# EAGLE schematic Controller3 (EAGLE 6.1)
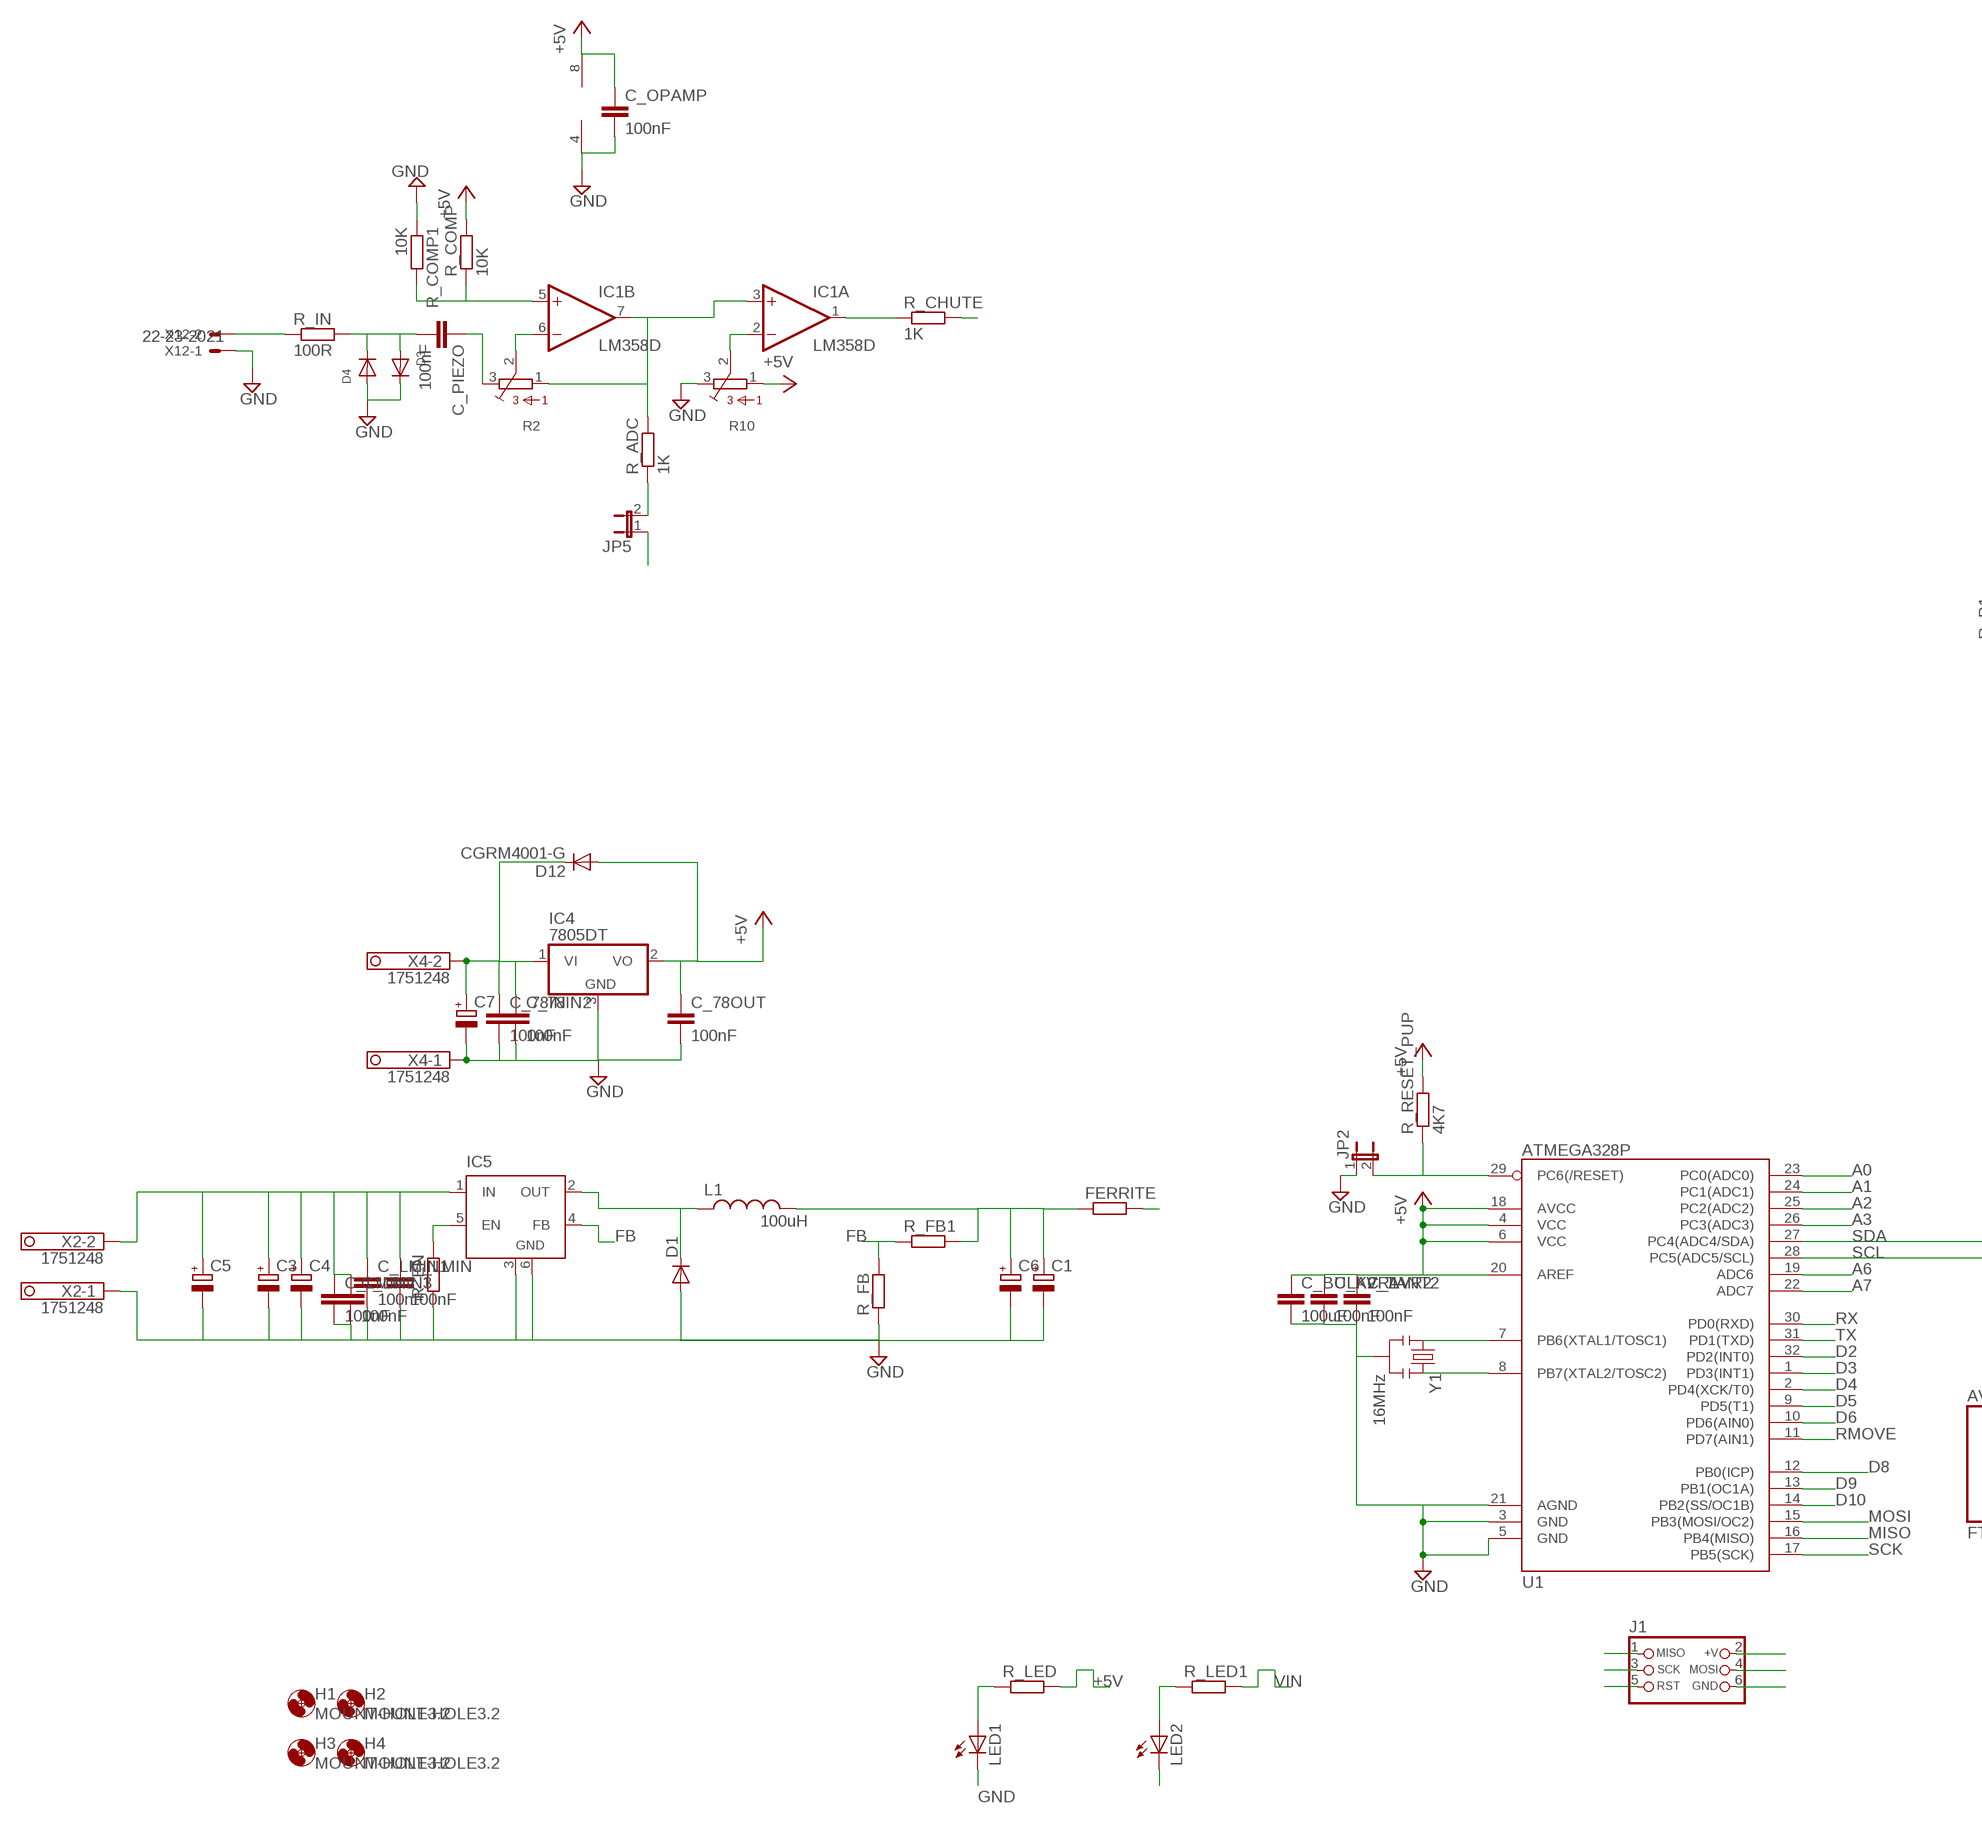
[diagram p0: schematic, sheet 1, part 1 of 2]
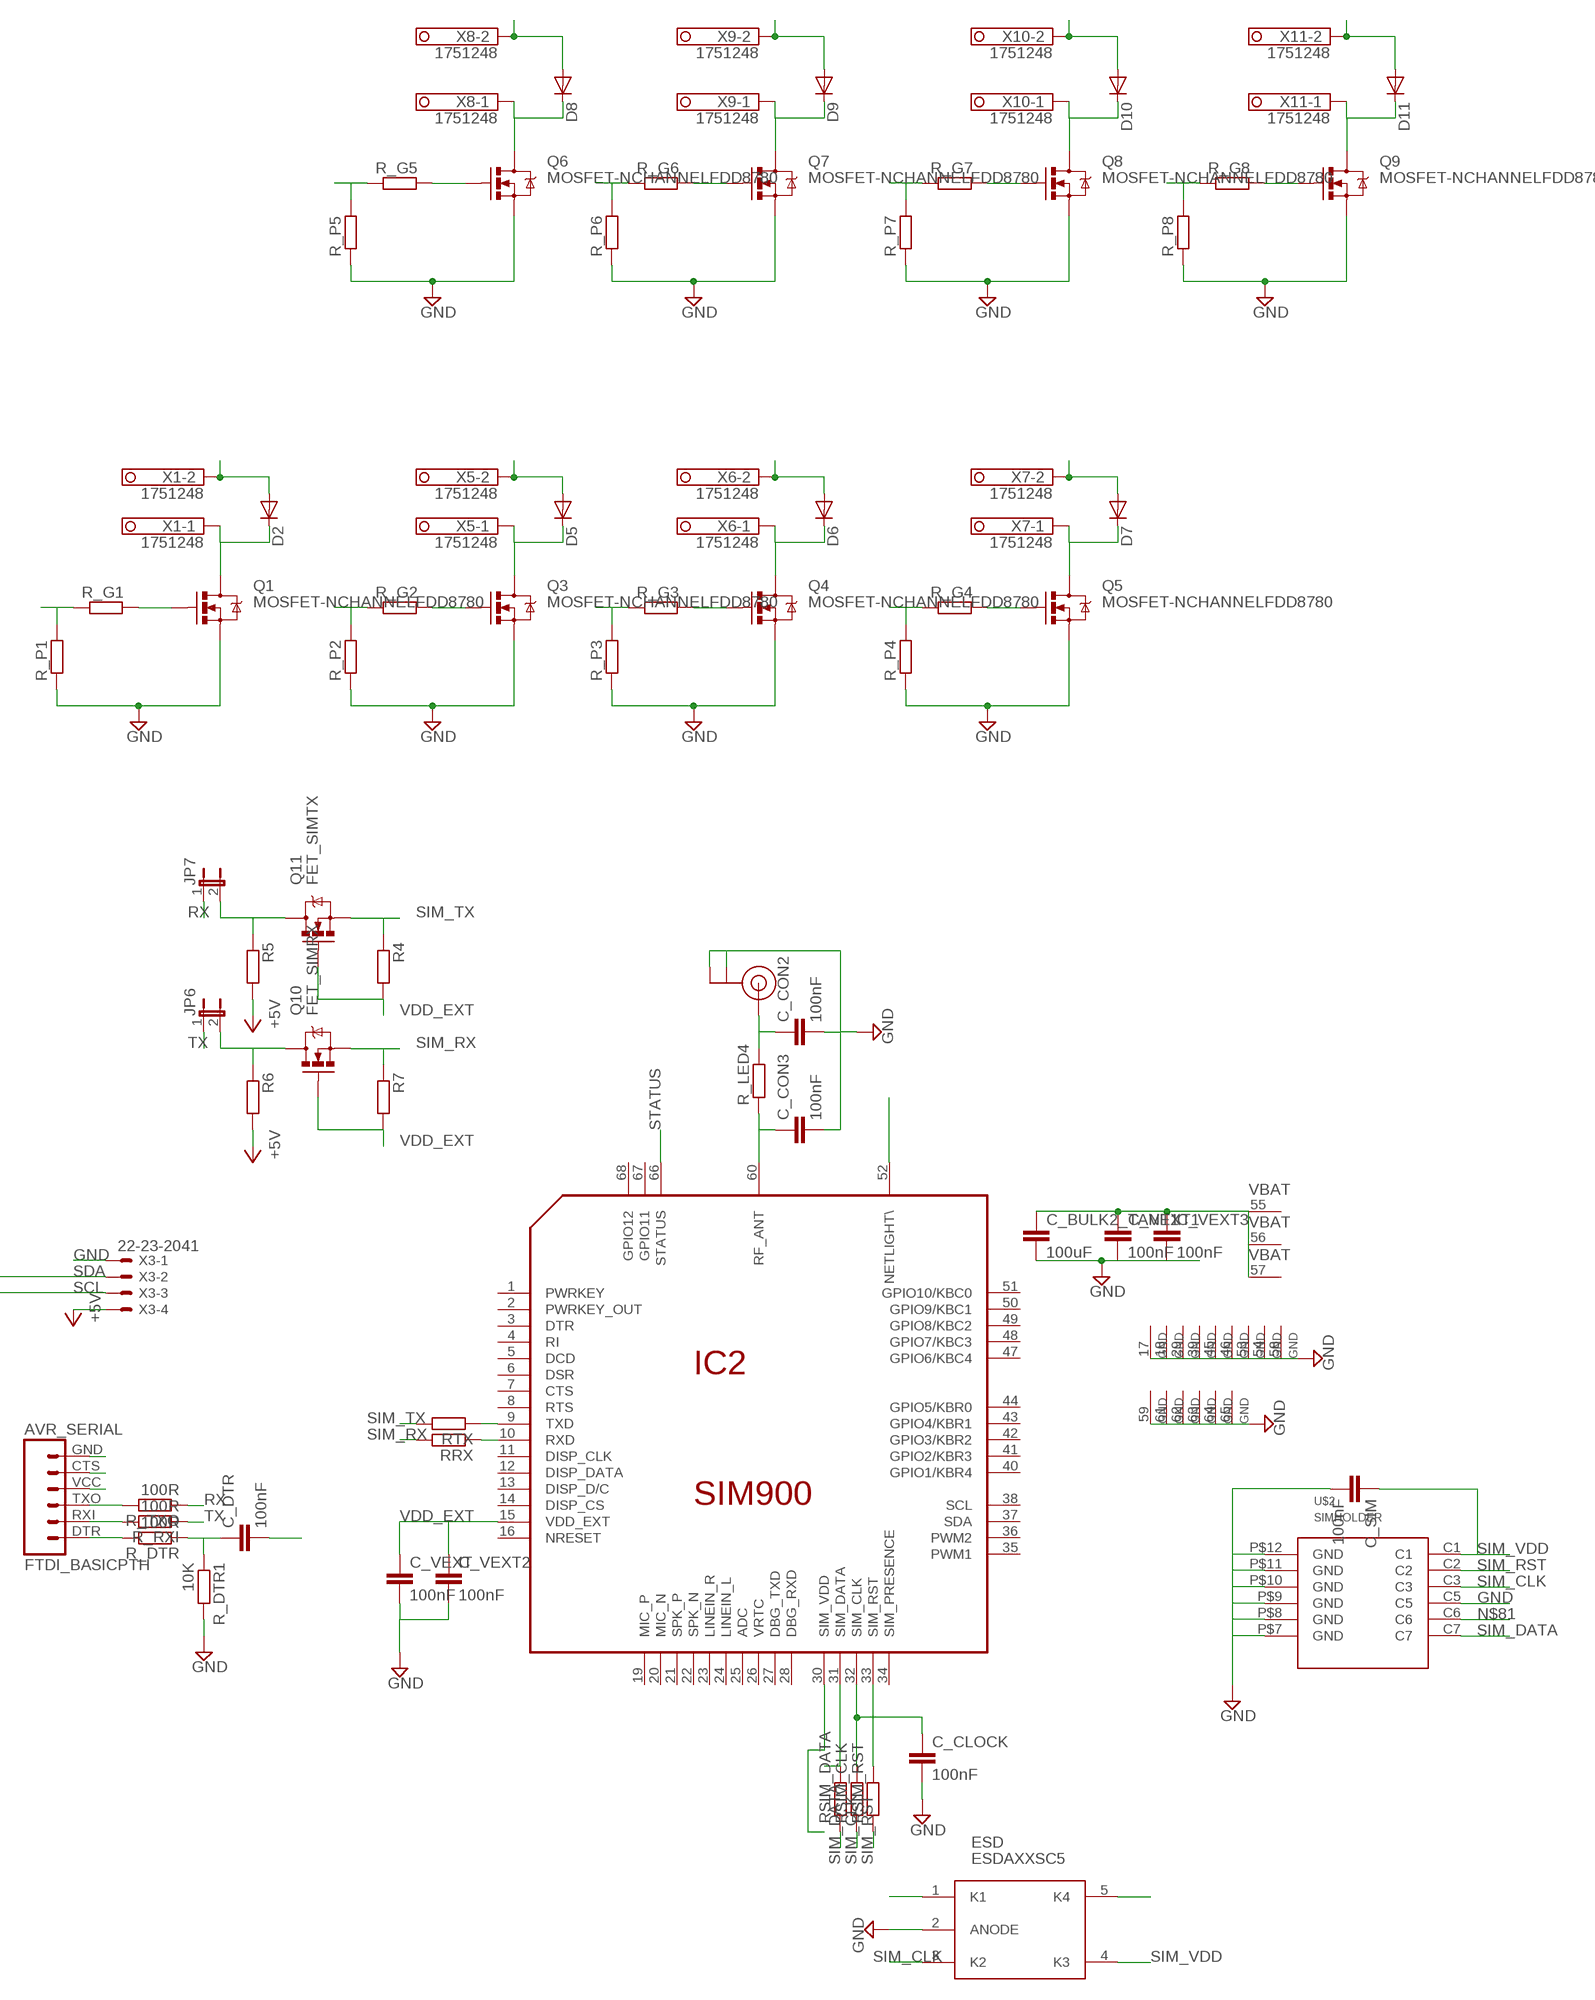
[diagram p1: schematic, sheet 1, part 2 of 2]

## Parts
AVR_SERIAL  FTDI_BASICPTH  [FTDI_BASIC]
C1  CPOL-EUF  [PANASONIC_F]
C3  CPOL-EUF  [PANASONIC_F]
C4  CPOL-EUF  [PANASONIC_F]
C5  CPOL-EUF  [PANASONIC_F]
C6  CPOL-EUF  [PANASONIC_F]
C7  CPOL-EUF  [PANASONIC_F]
C_78IN  100nF  C-EUC0805  [C0805]
C_78IN2  100nF  C-EUC0805  [C0805]
C_78OUT  100nF  C-EUC0805  [C0805]
C_AVR1  100nF  C-EUC0805K  [C0805K]
C_AVR2  100nF  C-EUC0805  [C0805]
C_BULK2_TANT1  100uF  C-EUC1210  [C1210]
C_BULK2_TANT2  100uF  C-EUC1210  [C1210]
C_CLOCK  100nF  C-EUC0805  [C0805]
C_CON2  100nF  C-EUC0805  [C0805]
C_CON3  100nF  C-EUC0805  [C0805]
C_DTR  100nF  C-EUC0805K  [C0805K]
C_LMIN  100nF  C-EUC0805  [C0805]
C_LMIN1  100nF  C-EUC0805  [C0805]
C_LMIN2  100nF  C-EUC0805  [C0805]
C_LMIN3  100nF  C-EUC0805  [C0805]
C_OPAMP  100nF  C-EUC0805K  [C0805K]
C_PIEZO  100nF  C-EUC0805K  [C0805K]
C_SIM  100nF  C-EUC0805  [C0805]
C_VEXT  100nF  C-EUC0805K  [C0805K]
C_VEXT1  100nF  C-EUC0805K  [C0805K]
C_VEXT2  100nF  C-EUC0805K  [C0805K]
C_VEXT3  100nF  C-EUC1210  [C1210]
D1  DIODESMB  [SMB-DIODE]
D2  DIODESMA  [SMA-DIODE]
D3  DIODESOD-123  [SOD-123]
D4  DIODESOD-123  [SOD-123]
D5  DIODESMA  [SMA-DIODE]
D6  DIODESMA  [SMA-DIODE]
D7  DIODESMA  [SMA-DIODE]
D8  DIODESMA  [SMA-DIODE]
D9  DIODESMA  [SMA-DIODE]
D10  DIODESMA  [SMA-DIODE]
D11  DIODESMA  [SMA-DIODE]
D12  CGRM4001-G  [SOD-123_MINI-SMA]
ESD  ESDAXXSC5  [SOT23-5]
FERRITE  R-EU_R0805  [R0805]
H1  MOUNT-HOLE3.2  [3,2]
H2  MOUNT-HOLE3.2  [3,2]
H3  MOUNT-HOLE3.2  [3,2]
H4  MOUNT-HOLE3.2  [3,2]
IC1  LM358D  [SO08]
IC2  SIM900  [SIM900]
IC4  7805DT  [TO252]
IC5  LM2596S  [TO263-5]
J1  CON_HEADER_PRG_AVR_ICSP  [HEADER_PRG_2X03]
JP2  JUMPER-2SMD-NC  [SJ_2S]
JP5  JUMPER-2SMD-NC  [SJ_2S]
JP6  JUMPER-2PTH_LOCK  [1X02_LOCK]
JP7  JUMPER-2PTH_LOCK  [1X02_LOCK]
L1  100uH  BOURNS-SRR1280  [BOURNS-SRR1280]
LED1  LEDCHIP-LED0805  [CHIP-LED0805]
LED2  LEDCHIP-LED0805  [CHIP-LED0805]
Q1  MOSFET-NCHANNELFDD8780  [DPAK]
Q3  MOSFET-NCHANNELFDD8780  [DPAK]
Q4  MOSFET-NCHANNELFDD8780  [DPAK]
Q5  MOSFET-NCHANNELFDD8780  [DPAK]
Q6  MOSFET-NCHANNELFDD8780  [DPAK]
Q7  MOSFET-NCHANNELFDD8780  [DPAK]
Q8  MOSFET-NCHANNELFDD8780  [DPAK]
Q9  MOSFET-NCHANNELFDD8780  [DPAK]
Q10  FET_SIMRX  MOSFET-NCHANNELBSS138  [SOT23]
Q11  FET_SIMTX  MOSFET-NCHANNELBSS138  [SOT23]
R2  3386-F  [3386F]
R4  R-EU_R0805  [R0805]
R5  R-EU_R0805  [R0805]
R6  R-EU_R0805  [R0805]
R7  R-EU_R0805  [R0805]
R10  3386-F  [3386F]
R_ADC  1K  R-EU_M0805  [M0805]
R_CHUTE  1K  R-EU_M0805  [M0805]
R_COMP  10K  R-EU_M0805  [M0805]
R_COMP1  10K  R-EU_M0805  [M0805]
R_DTR  100R  R-EU_M0805  [M0805]
R_DTR1  10K  R-EU_M0805  [M0805]
R_EN  R-EU_M0805  [M0805]
R_FB  R-EU_M0805  [M0805]
R_FB1  R-EU_M0805  [M0805]
R_G1  R-EU_M0805  [M0805]
R_G2  R-EU_M0805  [M0805]
R_G3  R-EU_M0805  [M0805]
R_G4  R-EU_M0805  [M0805]
R_G5  R-EU_M0805  [M0805]
R_G6  R-EU_M0805  [M0805]
R_G7  R-EU_M0805  [M0805]
R_G8  R-EU_M0805  [M0805]
R_IN  100R  R-EU_M0805  [M0805]
R_LED  R-EU_M0805  [M0805]
R_LED1  R-EU_M0805  [M0805]
R_LED4  R-EU_R0805  [R0805]
R_P1  R-EU_M0805  [M0805]
R_P2  R-EU_M0805  [M0805]
R_P3  R-EU_M0805  [M0805]
R_P4  R-EU_M0805  [M0805]
R_P5  R-EU_M0805  [M0805]
R_P6  R-EU_M0805  [M0805]
R_P7  R-EU_M0805  [M0805]
R_P8  R-EU_M0805  [M0805]
R_RESET_PUP  4K7  R-EU_M0805  [M0805]
R_RXI  100R  R-EU_M0805  [M0805]
R_TXO  100R  R-EU_M0805  [M0805]
RRX  R-EU_M0805  [M0805]
RSIM_CLK  R-EU_M0805  [M0805]
RSIM_DATA  R-EU_M0805  [M0805]
RSIM_RST  R-EU_M0805  [M0805]
RTX  R-EU_M0805  [M0805]
U1  ATMEGA328P  ATMEGA328_SMT  [TQFP32-08]
U$1  U.FL  [U.FL]
U$2  SIMHOLDER  [WM9364CT-ND]
X1  1751248  [1751248]
X2  1751248  [1751248]
X3  22-23-2041  [22-23-2041]
X4  1751248  [1751248]
X5  1751248  [1751248]
X6  1751248  [1751248]
X7  1751248  [1751248]
X8  1751248  [1751248]
X9  1751248  [1751248]
X10  1751248  [1751248]
X11  1751248  [1751248]
X12  22-23-2021  [22-23-2021]
Y1  16MHz  RESONATOR16MHZ  [RESONATOR-SMD]

## Nets
+5V: C_78OUT.1 C_AVR1.1 C_AVR2.1 C_BULK2_TANT2.1 C_OPAMP.1 D12.A IC1.8(P:V+) IC4.2(VO) J1.2(+V) R5.2 R6.2 R10.1 R_COMP.2 R_LED.2 R_RESET_PUP.2 U1.4(VCC) U1.6(VCC) U1.18(AVCC) U1.20(AREF) X3.4
A0: JP5.1 U1.23(PC0(ADC0))
A1: U1.24(PC1(ADC1))
A2: U1.25(PC2(ADC2))
A3: U1.26(PC3(ADC3))
A6: U1.19(ADC6)
A7: U1.22(ADC7)
C_CLK: C_CLOCK.1 IC2.32(SIM_CLK) RSIM_CLK.2
D2: R_CHUTE.2 U1.32(PD2(INT0))
D3: R_G1.1 R_P1.2 U1.1(PD3(INT1))
D4: R_G2.1 R_P2.2 U1.2(PD4(XCK/T0))
D5: R_G5.1 R_P5.2 U1.9(PD5(T1))
D6: R_G6.1 R_P6.2 U1.10(PD6(AIN0))
D8: R_G4.1 R_P4.2 U1.12(PB0(ICP))
D9: R_G7.1 R_P7.2 U1.13(PB1(OC1A))
D10: R_G8.1 R_P8.2 U1.14(PB2(SS/OC1B))
FB: IC5.4(FB) R_FB1.1 R_FB.2
GND: AVR_SERIAL.GND C1.- C3.- C4.- C5.- C6.- C7.- C_78IN2.2 C_78IN.2 C_78OUT.2 C_AVR1.2 C_AVR2.2 C_BULK2_TANT1.2 C_BULK2_TANT2.2 C_CLOCK.2 C_CON2.2 C_CON3.2 C_LMIN1.2 C_LMIN2.2 C_LMIN3.2 C_LMIN.2 C_OPAMP.2 C_SIM.2 C_VEXT1.2 C_VEXT2.2 C_VEXT3.2 C_VEXT.2 D1.A D3.C D4.A ESD.2(ANODE) IC1.4(P:V-) IC2.17(GND) IC2.18(GND) IC2.29(GND) IC2.39(GND) IC2.45(GND) IC2.46(GND) IC2.53(GND) IC2.54(GND) IC2.58(GND) IC2.59(GND) IC2.61(GND) IC2.62(GND) IC2.63(GND) IC2.64(GND) IC2.65(GND) IC4.3(GND) IC5.3(GND) IC5.6(GND) J1.6(GND) JP2.1 LED1.C LED2.C Q1.3(S) Q3.3(S) Q4.3(S) Q5.3(S) Q6.3(S) Q7.3(S) Q8.3(S) Q9.3(S) R10.3 R_COMP1.1 R_DTR1.2 R_EN.1 R_FB.1 R_P1.1 R_P2.1 R_P3.1 R_P4.1 R_P5.1 R_P6.1 R_P7.1 R_P8.1 U1.3(GND) U1.5(GND) U1.21(AGND) U$2.C5 U$2.P$7(GND) U$2.P$8(GND) U$2.P$9(GND) U$2.P$10(GND) U$2.P$11(GND) U$2.P$12(GND) X2.1 X3.1 X4.1 X12.1 Y1.2
MISO: J1.1(MISO) U1.16(PB4(MISO))
MOSI: J1.4(MOSI) U1.15(PB3(MOSI/OC2))
N$1: Q1.1(G) R_G1.2
N$2: D1.C IC5.2(OUT) L1.P$2
N$3: C_PIEZO.1 R2.3
N$4: D2.C Q1.4(D) X1.1
N$5: U1.7(PB6(XTAL1/TOSC1)) Y1.1
N$6: C_CON2.1 R_LED4.2 U$1.P$3(SIGNAL)
N$7: C_CON3.1 IC2.60(RF_ANT) R_LED4.1
N$8: IC2.31(SIM_DATA) RSIM_DATA.2
N$9: U$1.P$1(GND) U$1.P$2(GND)
N$10: R_IN.1 X12.2
N$11: U1.8(PB7(XTAL2/TOSC2)) Y1.3
N$12: IC2.33(SIM_RST) RSIM_RST.2
N$13: IC1.6(B:-IN) R2.2
N$15: JP5.2 R_ADC.1
N$16: IC1.2(A:-IN) R10.2
N$18: C_BULK2_TANT1.1 C_VEXT1.1 C_VEXT3.1 FERRITE.2 IC2.55(VBAT) IC2.56(VBAT) IC2.57(VBAT)
N$20: LED2.A R_LED1.1
N$22: C_PIEZO.2 D3.A D4.C R_IN.2
N$26: IC1.3(A:+IN) IC1.7(B:OUT) R2.1 R_ADC.2
N$28: Q3.1(G) R_G2.2
N$36: D5.C Q3.4(D) X5.1
N$37: AVR_SERIAL.VCC
N$38: C_DTR.1 R_DTR1.1 R_DTR.1
N$39: AVR_SERIAL.TXO R_TXO.2
N$40: AVR_SERIAL.RXI R_RXI.2
N$41: AVR_SERIAL.DTR R_DTR.2
N$42: AVR_SERIAL.CTS
N$47: Q4.1(G) R_G3.2
N$48: D6.C Q4.4(D) X6.1
N$49: Q5.1(G) R_G4.2
N$50: LED1.A R_LED.1
N$51: D7.C Q5.4(D) X7.1
N$52: Q6.1(G) R_G5.2
N$53: D8.C Q6.4(D) X8.1
N$54: Q7.1(G) R_G6.2
N$55: D9.C Q7.4(D) X9.1
N$56: Q8.1(G) R_G7.2
N$57: D10.C Q8.4(D) X10.1
N$58: Q9.1(G) R_G8.2
N$59: D11.C Q9.4(D) X11.1
N$60: IC2.9(TXD) RTX.1
N$61: IC2.10(RXD) RRX.1
N$67: JP7.2 Q11.3(D) R5.1
N$71: JP6.2 Q10.3(D) R6.1
N$79: C1.+ C6.+ FERRITE.1 L1.P$1 R_FB1.2
N$80: IC5.5(EN) R_EN.2
N$81: U$2.C6
N$82: IC1.1(A:OUT) R_CHUTE.1
NETLIGHT: IC2.52(NETLIGHT\)
RESET: C_DTR.2 J1.5(RST) JP2.2 R_RESET_PUP.1 U1.29(PC6(/RESET))
RMOVE: R_G3.1 R_P3.2 U1.11(PD7(AIN1))
ROITE: IC1.5(B:+IN) R_COMP1.2 R_COMP.1
RX: JP7.1 R_TXO.1 U1.30(PD0(RXD))
SCK: J1.3(SCK) U1.17(PB5(SCK))
SCL: U1.28(PC5(ADC5/SCL)) X3.3
SDA: U1.27(PC4(ADC4/SDA)) X3.2
SIM_CLK: ESD.3(K2) RSIM_CLK.1 U$2.C3
SIM_DATA: ESD.1(K1) RSIM_DATA.1 U$2.C7
SIM_RST: ESD.5(K4) RSIM_RST.1 U$2.C2
SIM_RX: Q10.2(S) R7.1 RRX.2
SIM_TX: Q11.2(S) R4.1 RTX.2
SIM_VDD: C_SIM.1 ESD.4(K3) IC2.30(SIM_VDD) U$2.C1
STATUS: IC2.66(STATUS)
TX: JP6.1 R_RXI.1 U1.31(PD1(TXD))
VDD_EXT: C_VEXT2.1 C_VEXT.1 IC2.15(VDD_EXT) Q10.1(G) Q11.1(G) R4.2 R7.2
VIN: C3.+ C4.+ C5.+ C_LMIN1.1 C_LMIN2.1 C_LMIN3.1 C_LMIN.1 D2.A D5.A D6.A D7.A IC5.1(IN) R_LED1.2 X1.2 X2.2 X5.2 X6.2 X7.2
VIN2: C7.+ C_78IN2.1 C_78IN.1 D8.A D9.A D10.A D11.A D12.C IC4.1(VI) X4.2 X8.2 X9.2 X10.2 X11.2
Unconnected: IC2.1(PWRKEY) IC2.2(PWRKEY_OUT) IC2.3(DTR) IC2.4(RI) IC2.5(DCD) IC2.6(DSR) IC2.7(CTS) IC2.8(RTS) IC2.11(DISP_CLK) IC2.12(DISP_DATA) IC2.13(DISP_D/C) IC2.14(DISP_CS) IC2.16(NRESET) IC2.19(MIC_P) IC2.20(MIC_N) IC2.21(SPK_P) IC2.22(SPK_N) IC2.23(LINEIN_R) IC2.24(LINEIN_L) IC2.25(ADC) IC2.26(VRTC) IC2.27(DBG_TXD) IC2.28(DBG_RXD) IC2.34(SIM_PRESENCE) IC2.35(PWM1) IC2.36(PWM2) IC2.37(SDA) IC2.38(SCL) IC2.40(GPIO1/KBR4) IC2.41(GPIO2/KBR3) IC2.42(GPIO3/KBR2) IC2.43(GPIO4/KBR1) IC2.44(GPIO5/KBR0) IC2.47(GPIO6/KBC4) IC2.48(GPIO7/KBC3) IC2.49(GPIO8/KBC2) IC2.50(GPIO9/KBC1) IC2.51(GPIO10/KBC0) IC2.67(GPIO11) IC2.68(GPIO12)

## Library data of the parts
AVR_SERIAL = SparkFun-Connectors:FTDI_BASIC: FTDI Basic header with labels
C1 C3-C7 = rcl:CPOL-EU: POLARIZED CAPACITOR, European symbol
C_78IN C_78IN2 C_78OUT C_AVR1 C_AVR2 C_BULK2_TANT1 C_BULK2_TANT2 C_CLOCK C_CON2 C_CON3 C_DTR C_LMIN C_LMIN1-C_LMIN3 C_OPAMP C_PIEZO C_SIM C_VEXT C_VEXT1-C_VEXT3 = resistor:C-EU: CAPACITOR, European symbol
D1 D2 D5-D11 = SparkFun-DiscreteSemi:DIODE: Diode
D3 D4 = adafruit:DIODE: Diode
D12 = diode:CGRM400*-G: Molded plasitc,JEDEC SOD-123/Mini SMA Source: Comchip CGRM4001-G.pdf
ESD = wes:ESDAXXSC5
FERRITE R4-R7 = rcl:R-EU_: RESISTOR, European symbol
H1-H4 = holes:MOUNT-HOLE: MOUNTING HOLE with drill center marker
IC1 = linear:LM358: OP AMP also LM158; LM258; LM2904 Source: http://cache.national.com/ds/LM/LM158.pdf
IC2 = sim900:SIM900
IC4 = adafruit:78*: Positive VOLTAGE REGULATOR Added bigger pads to the TO-92 package
IC5 = linear:LM2596S: STEP-DOWN VOLTAGE REGULATOR
J1 = nonolith:CON_HEADER_PRG_AVR_ICSP: 2x3 AVR ICSP programming header
JP2 JP5-JP7 = SparkFun-Passives:JUMPER-2: Jumper Basic 0.1" spaced jumper. Use with breakaway headers.
L1 = inductor-sen:BOURNS-SRR1280
LED1 LED2 = led:LED: LED OSRAM: - CHIPLED LG R971, LG N971, LY N971, LG Q971, LY Q971, LO R971, LY R971 LH N974, LH R974 LS Q976, LO Q976, LY Q976 LO Q996 - Hyper CHIPLED LW Q18S LB Q993, LB Q99A, LB R99A - SideLED LS A670, LO A670, LY A670, LG A670, LP A670 LB A673, LV A673, LT A673, LW A673 LH A674 LY A675 LS A676, LA A676, LO A676, LY A676, LW A676 LS A679, LY A679, LG A679 - Hyper Micro SIDELED® LS Y876, LA Y876, LO Y876, LY Y876 LT Y87S - SmartLED LW L88C, LW L88S LB L89C, LB L89S, LG L890 LS L89K, LO L89K, LY L89K LS L896, LA L896, LO L896, LY L896 - TOPLED LS T670, LO T670, LY T670, LG T670, LP T670 LSG T670, LSP T670, LSY T670, LOP T670, LYG T670 LG T671, LOG T671, LSG T671 LB T673, LV T673, LT T673, LW T673 LH T674 LS T676, LA T676, LO T676, LY T676, LB T676, LH T676, LSB T676, LW T676 LB T67C, LV T67C, LT T67C, LS T67K, LO T67K, LY T67K, LW E67C LS E67B, LA E67B, LO E67B, LY E67B, LB E67C, LV E67C, LT E67C LW T67C LS T679, LY T679, LG T679 LS T770, LO T770, LY T770, LG T770, LP T770 LB T773, LV T773, LT T773, LW T773 LH T774 LS E675, LA E675, LY E675, LS T675 LS T776, LA T776, LO T776, LY T776, LB T776 LHGB T686 LT T68C, LB T68C - Hyper Mini TOPLED® LB M676 - Mini TOPLED Santana® LG M470 LS M47K, LO M47K, LY M47K Source: http://www.osram.convergy.de LUXEON: - LUMILED® LXK2-PW12-R00, LXK2-PW12-S00, LXK2-PW14-U00, LXK2-PW14-V00 LXK2-PM12-R00, LXK2-PM12-S00, LXK2-PM14-U00 LXK2-PE12-Q00, LXK2-PE12-R00, LXK2-PE12-S00, LXK2-PE14-T00, LXK2-PE14-U00 LXK2-PB12-K00, LXK2-PB12-L00, LXK2-PB12-M00, LXK2-PB14-N00, LXK2-PB14-P00, LXK2-PB14-Q00 LXK2-PR12-L00, LXK2-PR12-M00, LXK2-PR14-Q00, LXK2-PR14-R00 LXK2-PD12-Q00, LXK2-PD12-R00, LXK2-PD12-S00 LXK2-PH12-R00, LXK2-PH12-S00 LXK2-PL12-P00, LXK2-PL12-Q00, LXK2-PL12-R00 Source: www.luxeon.com KINGBRIGHT: KA-3528ASYC Source: www.kingbright.com
Q1 Q3-Q9 = SparkFun-DiscreteSemi:MOSFET-NCHANNEL: Common NMOSFET Parts MFG P/N Store ID Prod ID FDD8780 TRANS-09984 SI7820DN TRANS-11055 FDS6630A IC-08089 2N7002PW TRANS-11151 FQP30N06L COM-10213 TRANS-10060 BSS123LT1G TRANS-08345 BSS138 TRANS-00830 BS170 2N7000; PROD_ID: TRANS-09984
Q10 Q11 = SparkFun-DiscreteSemi:MOSFET-NCHANNEL: Common NMOSFET Parts MFG P/N Store ID Prod ID FDD8780 TRANS-09984 SI7820DN TRANS-11055 FDS6630A IC-08089 2N7002PW TRANS-11151 FQP30N06L COM-10213 TRANS-10060 BSS123LT1G TRANS-08345 BSS138 TRANS-00830 BS170 2N7000; PROD_ID: TRANS-00830
R2 R10 = bourns:3386-: 3386 Series 3/8" Square Trimmer
R_ADC R_CHUTE R_COMP R_COMP1 R_DTR R_DTR1 R_EN R_FB R_FB1 R_G1-R_G8 R_IN R_LED R_LED1 R_LED4 R_P1-R_P8 R_RESET_PUP R_RXI R_TXO RRX RSIM_CLK RSIM_DATA RSIM_RST RTX = resistor:R-EU_: RESISTOR, European symbol
U1 = SparkFun-DigitalIC:ATMEGA328_SMT: 32-Pin Atmega328 part Commonly used on Arduino compatible boards Available in QFP and QFN packages TQFP is IC-09069 QFN is non-stock; PROD_ID: IC-09069
U$1 = SparkFun-Connectors:U.FL: SMD antenna connector- WRL-09144
U$2 = wes:SIMHOLDER
X1 X2 X4-X11 = con-phoenix-350:1751248: MKDS 1/ 2-3,5 Printklemme Nennstrom: 10 A Bemessungsspannung: 160 V Raster: 3,5 mm Polzahl: 2 Montageart: Löten Anschlussart: Schraubanschluss Anschlussrichtung vom Leiter zur Platine: 0° Source: http://eshop.phoenixcontact.com .. 1751248.pdf; OC_FARNELL: unknown; OC_NEWARK: unknown
X3 = con-molex:22-23-2041: .100" (2.54mm) Center Header - 4 Pin; MF: MOLEX; MPN: 22-23-2041; OC_FARNELL: 1462920; OC_NEWARK: 38C0355
X12 = con-molex:22-23-2021: .100" (2.54mm) Center Header - 2 Pin; MF: MOLEX; MPN: 22-23-2021; OC_FARNELL: 1462926; OC_NEWARK: 25C3832
Y1 = SparkFun-FreqCtrl:RESONATOR: Resonator Small SMD resonator. Used, eg, on the Arduino Pro/ Pro Mini boards. 8MHz- XTAL-08895 16MHz- XTAL-08900; PROD_ID: XTAL-08900